# Altium schematic sheet RomanK.SchDoc
size 420 x 297 mm
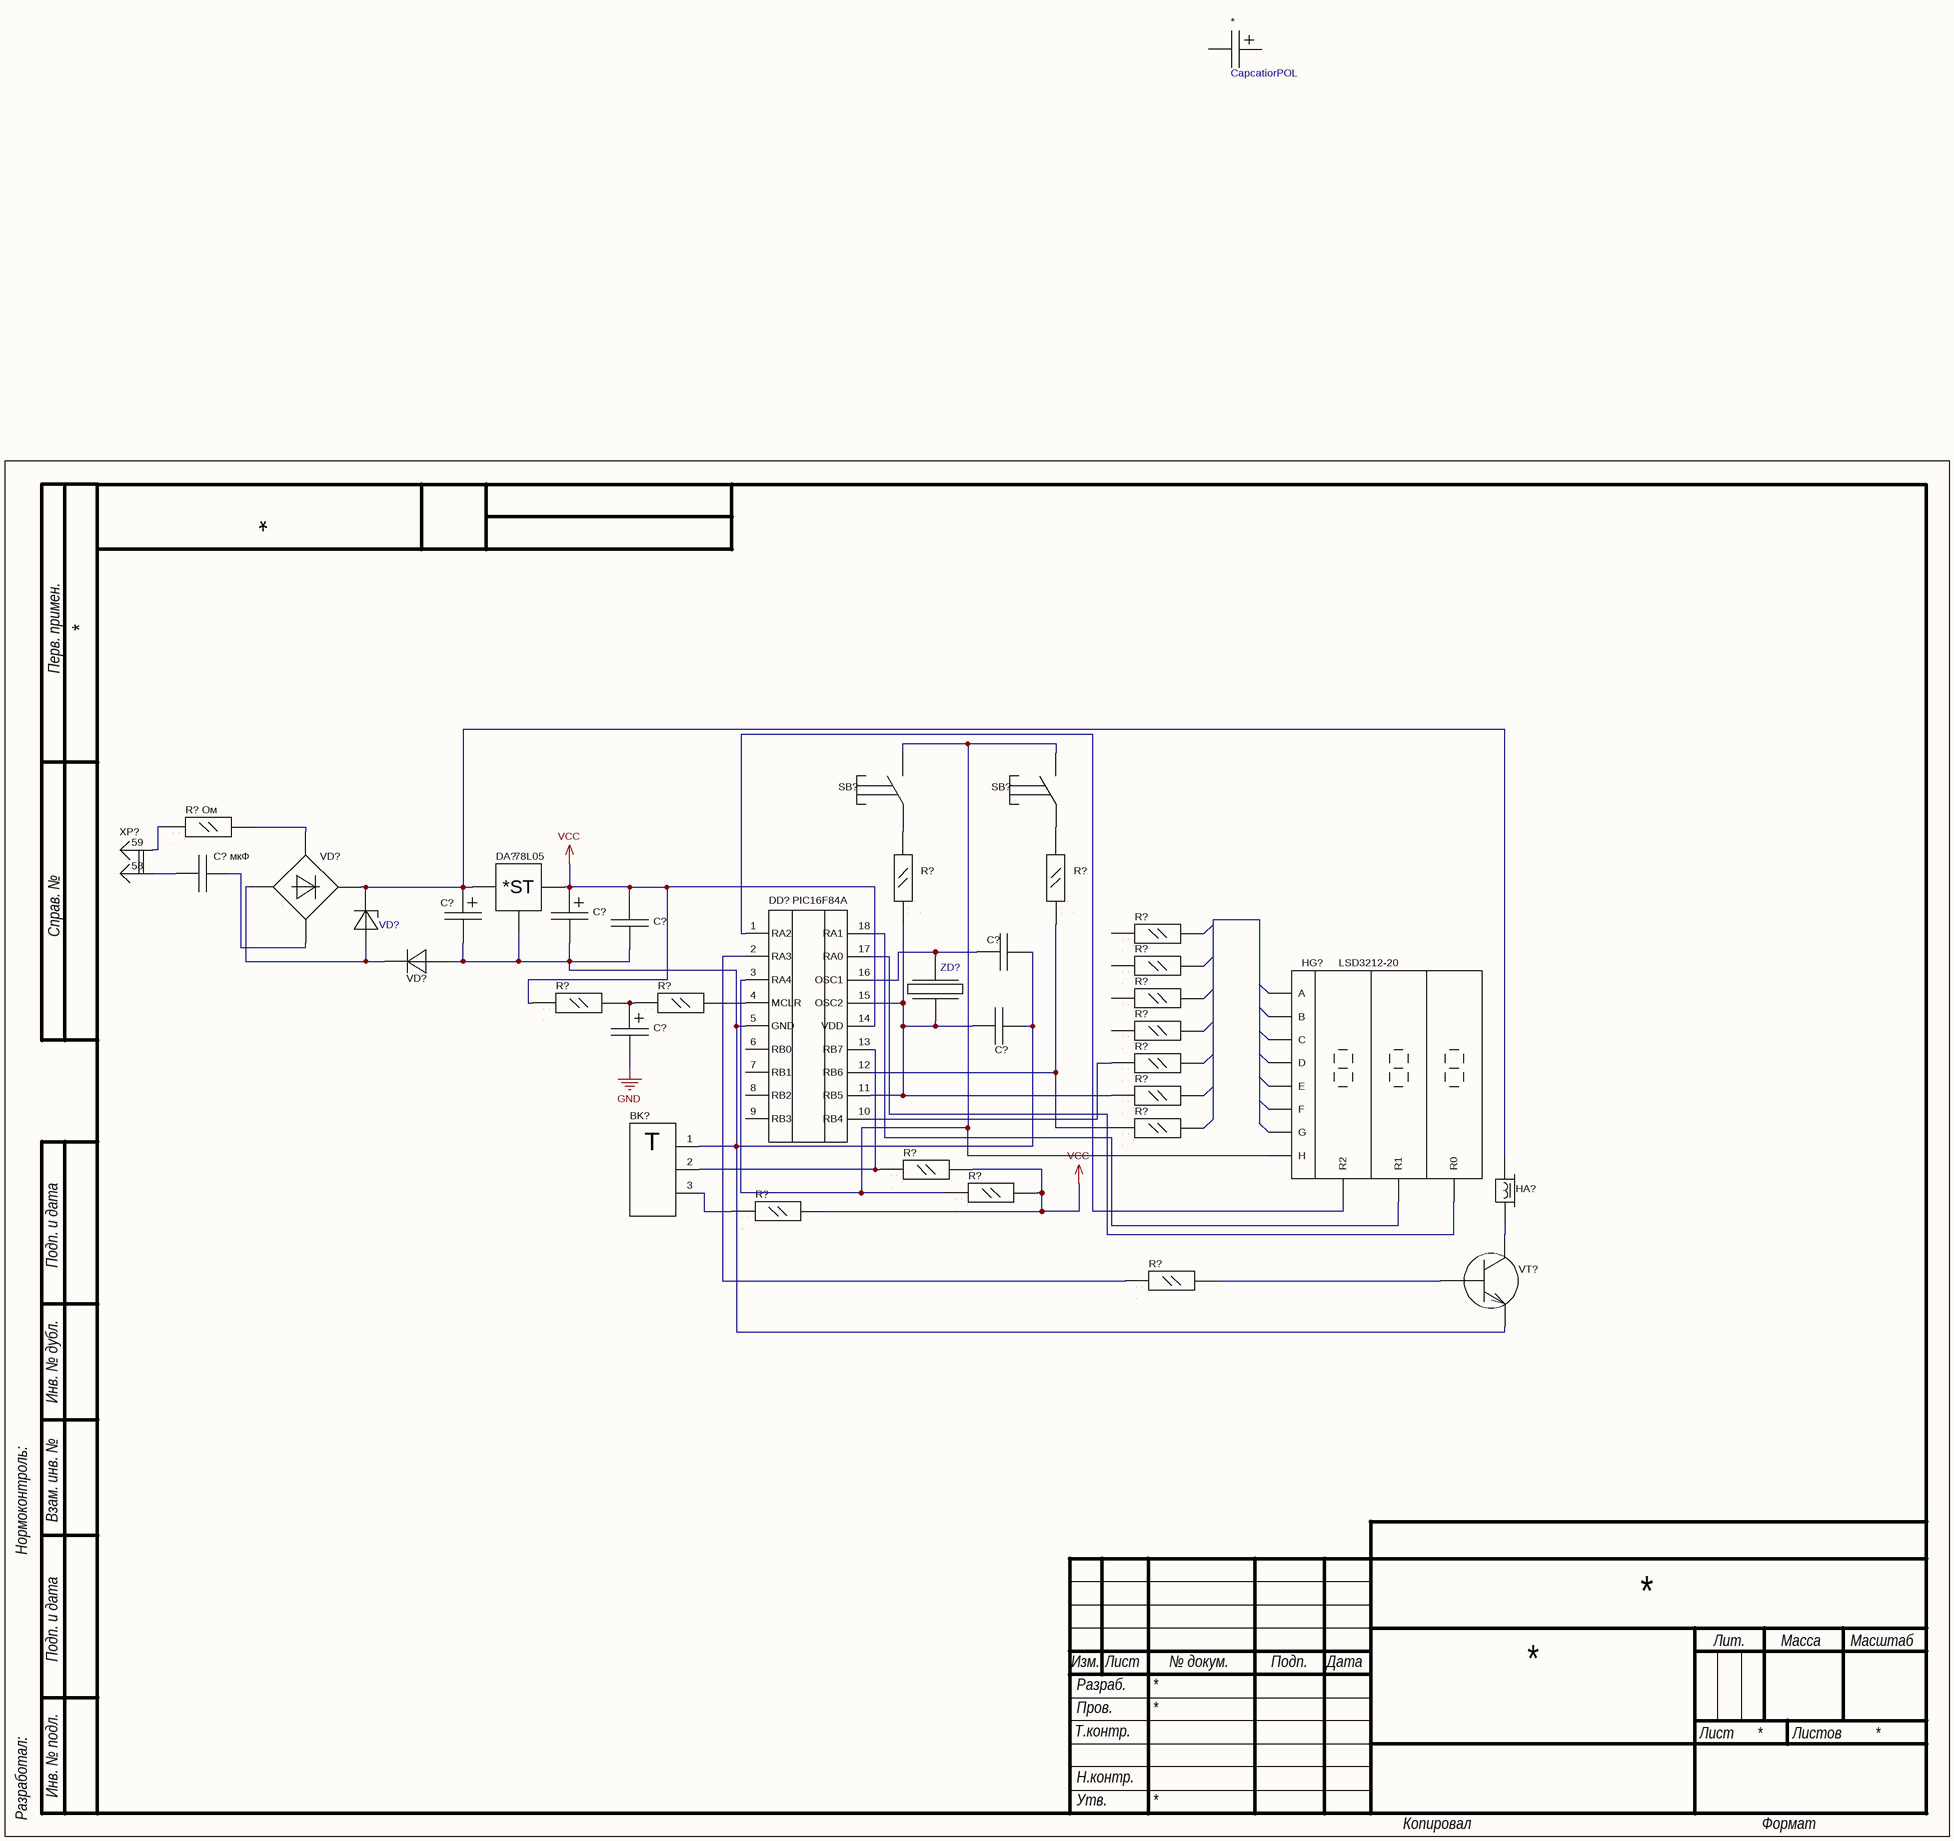
[diagram p0: RomanK.SchDoc]

## Parts
(Parts that share a designator on the sheet are numbered #1, #2 ... from top to bottom, then left to right.)
*  CapcatiorPOL
BK?  DS18B20  (value not drawn)
C?#1  CapcatiorPOL  (value not drawn)
C?#2  CapcatiorPOL  (value not drawn)
C?#3  CapacitorBI  (value not drawn)
C?#4  CapacitorBI  (value not drawn)
C?#5  CapacitorBI  (value not drawn)
C?#6  CapcatiorPOL  (value not drawn)
C?_мкФ  CapacitorBI  (value not drawn)
DA?  78L05
DD?  PIC16F84A
HA?  HC0903A  (value not drawn)
HG?  LSD3212-20
R?#1  resistor  (value not drawn)
R?#2  resistor  (value not drawn)
R?#3  resistor  (value not drawn)
R?#4  resistor  (value not drawn)
R?#5  resistor  (value not drawn)
R?#6  resistor  (value not drawn)
R?#7  resistor  (value not drawn)
R?#8  resistor  (value not drawn)
R?#9  resistor  (value not drawn)
R?#10  resistor  (value not drawn)
R?#11  resistor  (value not drawn)
R?#12  resistor  (value not drawn)
R?#13  resistor  (value not drawn)
R?#14  resistor  (value not drawn)
R?#15  resistor  (value not drawn)
R?_Ом  resistor  (value not drawn)
SB?#1  Button  (value not drawn)
SB?#2  Button  (value not drawn)
VD?#1  diode bridge  (value not drawn)
VD?#2  Stabilitron  (value not drawn)
VD?#3  Diod  (value not drawn)
VT?  transistor  (value not drawn)
XP?  Power  (value not drawn)
ZD?  kwarz  (value not drawn)

## Nets
GND: C?#6.45
VCC: C?#2.44 C?#3.45 DA?.57 DD?.14(VDD) R?#6.2 R?#12.1 R?#13.1 R?#14.1
NetBK?_1: BK?.1 C?#1.45 C?#2.45 C?#3.44 C?#4.45 C?#5.44 DA?.56 DD?.5(GND) VD?#3.63 VT?.3
NetBK?_2: BK?.2 DD?.13(RB7) R?#12.2
NetBK?_3: BK?.3 R?#14.2
NetC?#1_44: C?#1.44 DA?.55 HA?.75 VD?#1.66 VD?#2.64
NetC?#4_44: C?#4.44 DD?.16(OSC1) ZD?.48
NetC?#5_45: C?#5.45 DD?.11(RB5) DD?.15(OSC2) R?#1.2 R?#10.2 ZD?.49
NetC?#6_44: C?#6.44 R?#6.1 R?#7.2
NetC?_мкФ_44: C?_мкФ.44 VD?#1.67
NetC?_мкФ_45: C?_мкФ.45 XP?.58
NetDD?_1: DD?.1(RA2) HG?.9(R2)
NetDD?_2: DD?.2(RA3) R?#15.2
NetDD?_3: DD?.3(RA4) HG?.8(H) R?#13.2 SB?#1.47 SB?#2.47
NetDD?_4: DD?.4(MCLR) R?#7.1
NetDD?_10: DD?.10(RB4) R?#9.2
NetDD?_12: DD?.12(RB6) R?#2.2 R?#11.2
NetDD?_17: DD?.17(RA0) HG?.9(R0)
NetDD?_18: DD?.18(RA1) HG?.9(R1)
NetHA?_76: HA?.76 VT?.2
NetR?#1_1: R?#1.1 SB?#1.46
NetR?#2_1: R?#2.1 SB?#2.46
NetR?#15_1: R?#15.1 VT?.1
NetR?_Ом_1: R?_Ом.1 VD?#1.65
NetR?_Ом_2: R?_Ом.2 XP?.59
NetVD?#1_68: VD?#1.68 VD?#2.63 VD?#3.64

Not connected (* = marked no-connect by the designer): * 44 45; DD? 6(RB0) 7(RB1) 8(RB2) 9(RB3); HG? 1(A) 2(B) 3(C) 4(D) 5(E) 6(F) 7(G); R?#3 1(43) 2(42); R?#4 1(43) 2(42); R?#5 1(43) 2(42); R?#8 1(43) 2(42); R?#9 1(43); R?#10 1(43); R?#11 1(43)

## Notes on the sheet
- Перв. примен.
- Справ. №
- Подп. и дата
- Инв. № дубл.
- Нормоконтроль:
- Взам. инв. №
- Изм.
- Лист
- № докум.
- Подп.
- Дата
- Лит.
- Масса
- Масштаб
- Т.контр.
- Пров.
- Разраб.
- Листов
- Разработал:
- Инв. № подл.
- Н.контр.
- Утв.
- Копировал
- Формат
- (in symbol 78L05) *ST
- (in symbol DS18B20) T